# EAGLE design 42mm_Erweiterungsplatine (EAGLE 9.6.2)
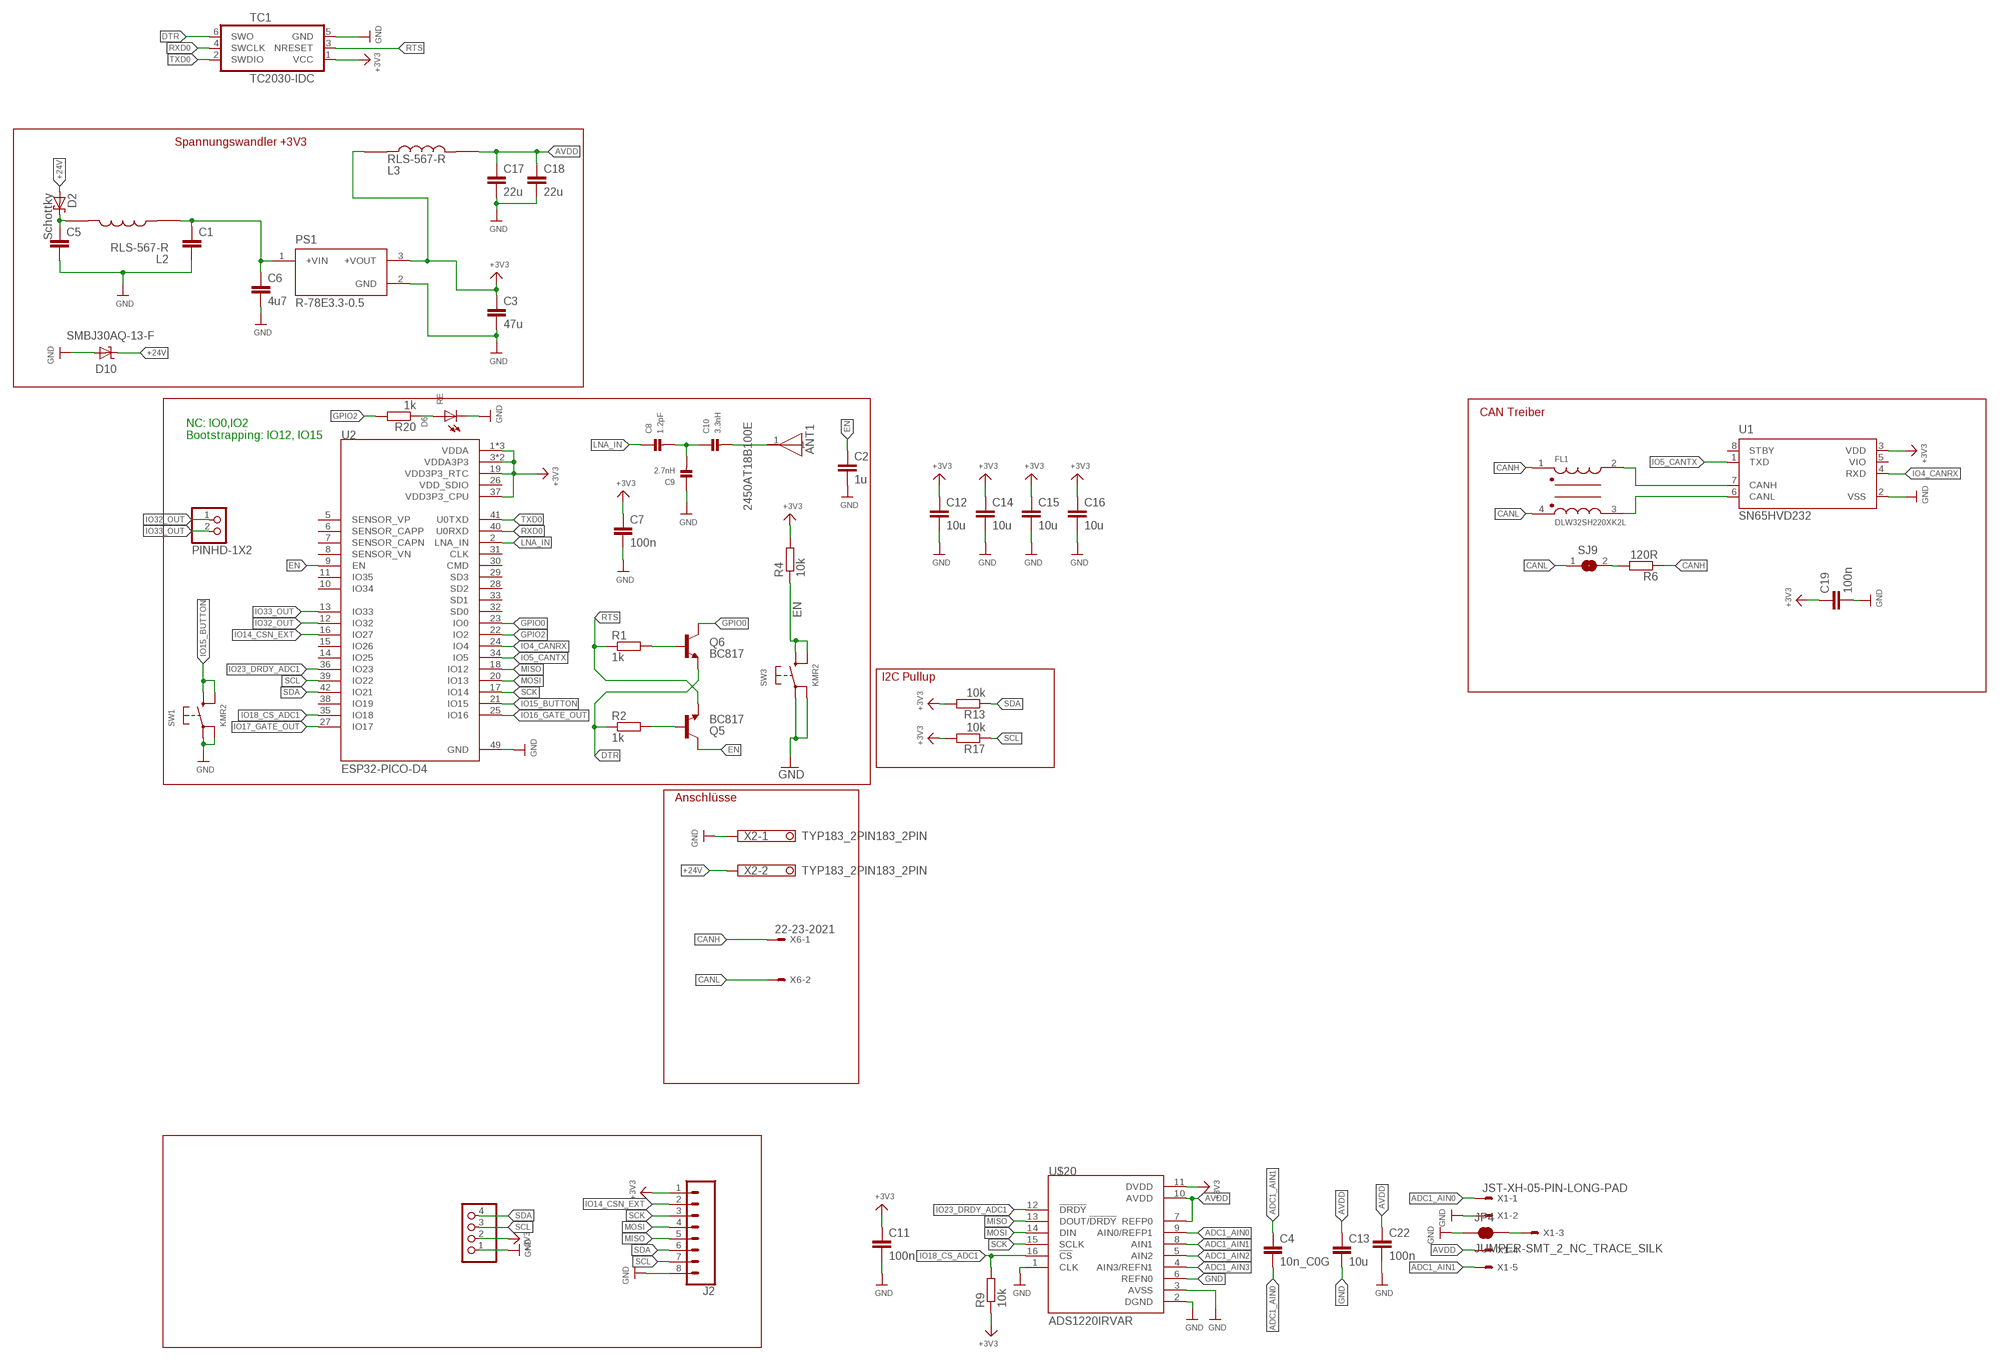
[diagram p0: schematic, sheet 1]

## Parts
ANT1  2450AT18B100E  [ANT_2450AT18B100E]
C1  C-EUC1206K  [C1206K]
C2  1u  C-EUC0805  [C0805]
C3  47u  C-EUC0805  [C0805]
C4  10n_C0G  C-EUC0805  [C0805]
C5  C-EUC1206K  [C1206K]
C6  4u7  C-EUC0805  [C0805]
C7  100n  C-EUC0805  [C0805]
C8  1.2pF  CAP_CERAMIC_0402MP  [_0402MP]
C9  2.7nH  CAP_CERAMIC_0402MP  [_0402MP]
C10  3.3nH  CAP_CERAMIC_0402MP  [_0402MP]
C11  100n  C-EUC0805  [C0805]
C12  10u  C-EUC0805  [C0805]
C13  10u  C-EUC0805  [C0805]
C14  10u  C-EUC0805  [C0805]
C15  10u  C-EUC0805  [C0805]
C16  10u  C-EUC0805  [C0805]
C17  22u  C-EUC0805  [C0805]
C18  22u  C-EUC0805  [C0805]
C19  100n  C-EUC0805  [C0805]
C22  100n  C-EUC0805  [C0805]
D2  Schottky  SCHOTTKY-DIODESMD  [SMB]
D6  RE  LEDCHIP-LED0805  [CHIP-LED0805]
D10  SMBJ30AQ-13-F  SUPPRESSOR-SMBJ  [SMBJ]
FL1  DLW32SH220XK2L  DLW32SH110XK2L  [FIL_DLW32SH110XK2L]
J2  CONN_08BM08B-SRSS-TB  [BM08B-SRSS-TB]
JP1  PINHD-1X4  [1X04]
JP4  JUMPER-SMT_2_NC_TRACE_SILK  [SMT-JUMPER_2_NC_TRACE_SILK]
JP5  PINHD-1X2  [1X02]
L2  RLS-567-R  [IND_RLS-567-R]
L3  RLS-567-R  [IND_RLS-567-R]
PS1  R-78E3.3-0.5  [CONV_R-78E3.3-0.5]
Q5  BC817  TRANSISTOR_NPNSOT23-3  [SOT23-3]
Q6  BC817  TRANSISTOR_NPNSOT23-3  [SOT23-3]
R1  1k  R-EU_R0805  [R0805]
R2  1k  R-EU_R0805  [R0805]
R4  10k  R-EU_R0805  [R0805]
R6  120R  R-EU_R0805  [R0805]
R9  10k  R-EU_R0805  [R0805]
R13  10k  R-EU_R0805  [R0805]
R17  10k  R-EU_R0805  [R0805]
R20  1k  R-EU_R0805  [R0805]
SJ9  SJ  [SJ]
SW1  KMR2  SWITCH_TACT_SMT4.6X2.8  [BTN_KMR2_4.6X2.8]
SW3  KMR2  SWITCH_TACT_SMT4.6X2.8  [BTN_KMR2_4.6X2.8]
TC1  TC2030-IDC  [TC2030-IDC]
U1  SN65HVD232  MCP2562-E/SN  [SOIC127P600X175-8N]
U2  ESP32-PICO-D4  [PQFN50P700X700X104-49N]
U$20  ADS1220IRVAR  [QFN50P350X350X100-17N214X214]
X1  JST-XH-05-PIN-LONG-PAD  [JST-XH-05-PACKAGE-LONG-PAD]
X2  TYP183_2PIN183_2PIN  [TYP183_FT_2PIN]
X6  22-23-2021  [22-23-2021]

## Nets
+3V3: C3.1 C7.1 C11.1 C12.1 C14.1 C15.1 C16.1 C19.1 J2.1 JP1.2 L3.1 PS1.3(+VOUT) R4.2 R9.1 R13.2 R17.2 TC1.1(VCC) U1.3(VDD) U2.1(VDDA) U2.3(VDDA3P3) U2.4(VDDA3P3) U2.19(VDD3P3_RTC) U2.37(VDD3P3_CPU) U2.43(VDDA) U2.46(VDDA) U$20.11(DVDD)
+24V: D2.A D10.C X2.2
ADC1_AIN0: C4.2 U$20.9(AIN0/REFP1) X1.1
ADC1_AIN1: C4.1 U$20.8(AIN1) X1.5
ADC1_AIN2: U$20.5(AIN2)
ADC1_AIN3: U$20.4(AIN3/REFN1)
AVDD [power]: C13.1 C17.1 C18.1 C22.1 L3.2 U$20.7(REFP0) U$20.10(AVDD) X1.4
CANH: FL1.1 R6.1 X6.1
CANL: FL1.4 SJ9.1 X6.2
DTR: Q6.2(E) R2.1 TC1.6(SWO)
EN: C2.1 Q5.3(C) R4.1 SW3.B'(S1) SW3.B(S) U2.9(EN)
GND: C1.2 C2.2 C3.2 C5.2 C6.2 C7.2 C9.1 C11.2 C12.2 C13.2 C14.2 C15.2 C16.2 C17.2 C18.2 C19.2 C22.2 D6.C D10.A J2.8 JP1.1 JP4.1 PS1.2(GND) SW1.A'(P1) SW1.A(P) SW3.A'(P1) SW3.A(P) TC1.5(GND) U1.2(VSS) U2.49(GND) U$20.1(CLK) U$20.2(DGND) U$20.3(AVSS) U$20.6(REFN0) X1.2 X2.1
GPIO0: Q6.3(C) U2.23(IO0)
GPIO2: R20.2 U2.22(IO2)
IO4_CANRX: U1.4(RXD) U2.24(IO4)
IO5_CANTX: U1.1(TXD) U2.34(IO5)
IO14_CSN_EXT: J2.2 U2.16(IO27)
IO15_BUTTON: SW1.B'(S1) SW1.B(S) U2.21(IO15)
IO16_GATE_OUT: U2.25(IO16)
IO17_GATE_OUT: U2.27(IO17)
IO18_CS_ADC1: R9.2 U2.35(IO18) U$20.16(!CS)
IO23_DRDY_ADC1: U2.36(IO23) U$20.12(!DRDY)
IO32_OUT: JP5.1 U2.12(IO32)
IO33_OUT: JP5.2 U2.13(IO33)
LNA_IN: C8.1 U2.2(LNA_IN)
MISO: J2.5 U2.18(IO12) U$20.13(DOUT/!DRDY)
MOSI: J2.4 U2.20(IO13) U$20.14(DIN)
N$2: C8.2 C9.2 C10.1
N$3: ANT1.1 C10.2
N$4: C5.1 D2.C L2.2
N$5: D6.A R20.1
N$6: C1.1 C6.1 L2.1 PS1.1(+VIN)
N$7: JP4.2 X1.3
N$8: FL1.2 U1.7(CANH)
N$11: FL1.3 U1.6(CANL)
N$12: Q5.1(B) R2.2
N$13: Q6.1(B) R1.2
N$16: R6.2 SJ9.2
RTS: Q5.2(E) R1.1 TC1.3(NRESET)
RXD0: TC1.4(SWCLK) U2.40(U0RXD)
SCK: J2.3 U2.17(IO14) U$20.15(SCLK)
SCL: J2.7 JP1.3 R17.1 U2.39(IO22)
SDA: J2.6 JP1.4 R13.1 U2.42(IO21)
TXD0: TC1.2(SWDIO) U2.41(U0TXD)
Unconnected: U1.8(STBY) U2.5(SENSOR_VP) U2.6(SENSOR_CAPP) U2.7(SENSOR_CAPN) U2.8(SENSOR_VN) U2.10(IO34) U2.11(IO35) U2.14(IO25) U2.15(IO26) U2.28(SD2) U2.29(SD3) U2.30(CMD) U2.31(CLK) U2.32(SD0) U2.33(SD1) U2.38(IO19)

## Notes on the sheet
- Spannungswandler +3V3
- CAN Treiber
- NC: IO0,IO2
  Bootstrapping: IO12, IO15
- I2C Pullup
- Anschlüsse

## Power pins joined to a net without a drawn wire
VDD_SDIO: U2.26(VDD_SDIO)
VIO: U1.5(VIO)

## Library data of the parts
ANT1 = 2450AT18B100E:2450AT18B100E: ANTENNA, CERAMIC, 2.45GHZ; Bandwidth: 100MHz; Frequency: 2.45GHz; Gain: -0.5dB; Impedance: 50ohm http://www.snapeda.com/parts/2450AT18B100E/Johanson/view-part/#; AVAILABILITY: Unavailable; DESCRIPTION: ANTENNA, CERAMIC, 2.45GHZ; Bandwidth: 100MHz; Frequency: 2.45GHz; Gain: -0.5dB; Impedance: 50ohm; MF: Johanson Technology; MP: 2450AT18B100E; PACKAGE: None; PRICE: None
C1-C7 C11-C19 C22 = rcl:C-EU: CAPACITOR, European symbol; SPICEPREFIX: C
C8-C10 = microbuilder:CAP_CERAMIC: Ceramic Capacitors 0402 - 0402 Surface Mount Capacitors 16pF 50V 5% [Digikey: 445-4899-2-ND] 18pF 50V 5% [Digikey: 490-1281-2-ND] 22pF 50V 5% [Digikey: 490-1283-2-ND] 68pF 50V 5% [Digikey: 490-1289-2-ND] 0.1uF 10V 10% [Digikey: 490-1318-2-ND] 1.0uF 6.3V 10% [Digikey: 490-1320-2-ND] 0603 - 0603 Surface Mount Capacitors 16 pF 50V 5% [Digikey: 445-5051-2-ND] 22 pF 50V [Digikey: PCC220ACVTR-ND] 33 pF 50V 5% [Digikey: 490-1415-1-ND] 56pF 50V 5% [Digikey: 490-1421-1-ND] 220pF 50V 5% [Digikey: 445-1285-1-ND] 680 pF 50V 2200 pF 50V 5% C0G [Digikey: 445-1297-1-ND] 5600 pF 100V 5% X7R [Digikey: 478-3711-1-ND] 0.1 µF 25V 10% [Digikey: PCC2277TR-ND] 0.22 µF 16V 10% X7R [Digikey: 445-1318-1-ND] 1.0 µF 25V 10% [Digikey: 445-5146-2-ND] 0603 - RF Specific 3pF 250V +/-0.1pF RF [Digikey: 712-1347-1-ND] 18 pF 250V 5% [Digikey: 478-3505-1-ND or 712-1322-1-ND] 56 pF 250V 5% C0G RF [Digikey: 490-4867-1-ND] 68 pF 250V RF [Digikey: 490-4868-1-ND] 0805 - 0805 Surface Mount Capacitors 220 pF 250V 2% RF Ceramic Capacitor [Digikey: 712-1398-1-ND] 1000 pF 50V 2% NP0 Ceramic Capacitor [Digikey: 478-3760-1-ND] 0.1 µF 25V 10% Ceramic Capacitor [Digikey: PCC1828TR-ND] 1.0 µF 16V 10% Ceramic Capacitor[Digikey: 490-1691-2-ND] 10.0 µF 10V 10% Ceramic Capacitor[Digikey: 709-1228-1-ND] 10.0 uF 16V 10% Ceramic Capacitor [Digikey: 478-5165-2-ND] 47 uF 6.3V 20% Ceramic Capacitor [Digikey: 587-1779-1-ND or 399-5506-1-ND] 1206 - 1206 Surface Mount Capacitors 47uF 10V 20% Ceramic Capacitor [Digikey: 490-5528-1-ND or 399-5508-1-ND or 445-6010-1-ND] 100uF 6.3V -20%, +80% Y5V Ceramic Capacitor (Digikey: 490-4512-1-ND, Mouser: 81-GRM31CF50J107ZE1L)
D2 = diode:SCHOTTKY-DIODE: Schottky Diode
D6 = led:LED: LED OSRAM: - CHIPLED LG R971, LG N971, LY N971, LG Q971, LY Q971, LO R971, LY R971 LH N974, LH R974 LS Q976, LO Q976, LY Q976 LO Q996 - Hyper CHIPLED LW Q18S LB Q993, LB Q99A, LB R99A - SideLED LS A670, LO A670, LY A670, LG A670, LP A670 LB A673, LV A673, LT A673, LW A673 LH A674 LY A675 LS A676, LA A676, LO A676, LY A676, LW A676 LS A679, LY A679, LG A679 - Hyper Micro SIDELED® LS Y876, LA Y876, LO Y876, LY Y876 LT Y87S - SmartLED LW L88C, LW L88S LB L89C, LB L89S, LG L890 LS L89K, LO L89K, LY L89K LS L896, LA L896, LO L896, LY L896 - TOPLED LS T670, LO T670, LY T670, LG T670, LP T670 LSG T670, LSP T670, LSY T670, LOP T670, LYG T670 LG T671, LOG T671, LSG T671 LB T673, LV T673, LT T673, LW T673 LH T674 LS T676, LA T676, LO T676, LY T676, LB T676, LH T676, LSB T676, LW T676 LB T67C, LV T67C, LT T67C, LS T67K, LO T67K, LY T67K, LW E67C LS E67B, LA E67B, LO E67B, LY E67B, LB E67C, LV E67C, LT E67C LW T67C LS T679, LY T679, LG T679 LS T770, LO T770, LY T770, LG T770, LP T770 LB T773, LV T773, LT T773, LW T773 LH T774 LS E675, LA E675, LY E675, LS T675 LS T776, LA T776, LO T776, LY T776, LB T776 LHGB T686 LT T68C, LB T68C - Hyper Mini TOPLED® LB M676 - Mini TOPLED Santana® LG M470 LS M47K, LO M47K, LY M47K Source: http://www.osram.convergy.de LUXEON: - LUMILED® LXK2-PW12-R00, LXK2-PW12-S00, LXK2-PW14-U00, LXK2-PW14-V00 LXK2-PM12-R00, LXK2-PM12-S00, LXK2-PM14-U00 LXK2-PE12-Q00, LXK2-PE12-R00, LXK2-PE12-S00, LXK2-PE14-T00, LXK2-PE14-U00 LXK2-PB12-K00, LXK2-PB12-L00, LXK2-PB12-M00, LXK2-PB14-N00, LXK2-PB14-P00, LXK2-PB14-Q00 LXK2-PR12-L00, LXK2-PR12-M00, LXK2-PR14-Q00, LXK2-PR14-R00 LXK2-PD12-Q00, LXK2-PD12-R00, LXK2-PD12-S00 LXK2-PH12-R00, LXK2-PH12-S00 LXK2-PL12-P00, LXK2-PL12-Q00, LXK2-PL12-R00 Source: www.luxeon.com KINGBRIGHT: KA-3528ASYC Source: www.kingbright.com
D10 = diode:SUPPRESSOR-: Suppressor diode
FL1 = DLW32SH110XK2L:DLW32SH110XK2L: 100UH-30%/+50% (AT 0.1MHZ) 150MA; AVAILABILITY: Unavailable; DESCRIPTION: 11µH @ 100kHz 2 Line Common Mode Choke Surface Mount 300mA DCR 400mOhm; MF: Murata; MP: DLW32SH110XK2L; PACKAGE: Horizontal-4 Murata; PRICE: None
J2 = SparkFun-Connectors:CONN_08: Multi connection point. Often used as Generic Header-pin footprint for 0.1 inch spaced/style header connections On any of the 0.1 inch spaced packages, you can populate with these: Break Away Headers - Straight <https://www.sparkfun.com/products/116> (PRT-00116) Break Away Male Headers - Right Angle <https://www.sparkfun.com/products/553> (PRT-00553) Female Headers <https://www.sparkfun.com/products/115> (PRT-00115) Break Away Headers - Machine Pin <https://www.sparkfun.com/products/117> (PRT-00117) Break Away Female Headers - Swiss Machine Pin <https://www.sparkfun.com/products/743> (PRT-00743) Arduino Stackable Header - 8 Pin <https://www.sparkfun.com/products/9279> (PRT-09279) For SCREWTERMINALS and SPRING TERMINALS visit here: Screw Terimnals on SparkFun.com <https://www.sparkfun.com/search/results?term=Screw+Terminals> (5mm/3.5mm/2.54mm spacing) This device is also useful as a general connection point to wire up your design to another part of your project. Our various solder wires solder well into these plated through hole pads. Hook-Up Wire - Assortment (Stranded, 22 AWG) <https://www.sparkfun.com/products/11375> (PRT-11375) Hook-Up Wire - Assortment (Solid Core, 22 AWG) <https://www.sparkfun.com/products/11367> (PRT-11367) View the entire wire category on our website here <https://www.sparkfun.com/categories/141> Special notes: Molex polarized connector foot print use with SKU : PRT-08231 with associated crimp pins and housings. 1MM SMD Version SKU: PRT-10208 NOTES ON THE VARIANTS LOCK and LOCK_LONGPADS... This footprint was designed to help hold the alignment of a through-hole component (i.e. 6-pin header) while soldering it into place. You may notice that each hole has been shifted either up or down by 0.005 of an inch from it's more standard position (which is a perfectly straight line). This slight alteration caused the pins (the squares in the middle) to touch the edges of the holes. Because they are alternating, it causes a "brace" to hold the component in place. 0.005 has proven to be the perfect amount of "off-center" position when using our standard breakaway headers. Although looks a little odd when you look at the bare footprint, once you have a header in there, the alteration is very hard to notice. Also,if you push a header all the way into place, it is covered up entirely on the bottom side.; PROD_ID: CONN-10556
JP1 = pinhead:PINHD-1X4: PIN HEADER
JP4 = SparkFun-Jumpers:JUMPER-SMT_2_NC_TRACE: Normally closed trace jumper This jumper has a trace between two pads so it's normally closed (NC). Use a razor knife to open the connection. For best results follow the IPC guidelines for cutting traces: Cutout at least 0.063 mm (0.005 in). Remove all loose material to clean up the cut area. Seal the cut with an approved epoxy. Reapply solder to reclose the connection.
JP5 = Connector:PINHD-1X2: PIN HEADER; CATEGORY: CONNECTOR; SUB-CATEGORY: PIN-HEADER
L2 L3 = RLS-567-R:RLS-567-R: Line Inductors for RECOM Power Supply Check prices <https://pricing.snapeda.com/parts/RLS-567-R/Recom%20Power/view-part?ref=eda>; AVAILABILITY: In Stock; DESCRIPTION: Line Inductors for RECOM Power Supply; MF: Recom Power; MP: RLS-567-R; PACKAGE: 1812 Recom Power; PRICE: None; PURCHASE-URL: https://pricing.snapeda.com/search/part/RLS-567-R/?ref=eda
PS1 = R-78E3.3-0.5:R-78E3.3-0.5: 0.5 Amp SIP3 Single Output Check prices <https://pricing.snapeda.com/parts/R-78E3.3-0.5/Recom%20Power/view-part?ref=eda>; AVAILABILITY: In Stock; DESCRIPTION: 0.5A DC/DC-Converter 'INNOLINE' SIP3 reg; MF: Recom Power; MP: R-78E3.3-0.5; PACKAGE: SIP-3 Recom Power; PRICE: None; PURCHASE-URL: https://pricing.snapeda.com/search/part/R-78E3.3-0.5/?ref=eda
Q5 Q6 = SparkFun:TRANSISTOR_NPN: Transistor NPN BJT configuration in SOT23 package. MMBT2222 is the common NPN we use. Double check BCE configuration again layout.
R1 R2 R4 R6 R9 R13 R17 R20 = rcl:R-EU_: RESISTOR, European symbol; SPICEPREFIX: R
SJ9 = jumper:SJ: SMD solder JUMPER
SW1 SW3 = microbuilder:SWITCH_TACT_SMT: SMT Tact Switches 6x6mm - Digikey: P12940SCT-ND KMR2 (4.6x2.8mm) - Digikey: 401-1426-1-ND EVQ-PQHB55 - Light Touch, 160GF (4.5x4.5mm) - Digikey: P8090SCT-ND KMT0 - KMT021 NGJ LHS (etc.) IP68/Waterproof - Digikey: CKN10289CT-ND
TC1 = TC2030-IDC:TC2030-IDC: Tag-Connect In Circuit Programming & Debug Cable 6 Pin http://www.tag-connect.com; AVAILABILITY: Unavailable; DESCRIPTION: Cable Adapter 6 Pos; MF: Tag-Connect LLC; MP: TC2030-IDC; PACKAGE: None; PRICE: None
U1 = MCP2562-E_SN:MCP2562-E/SN: MCP2562 Series 5 V Surface Mount High-Speed CAN Transceiver - SOIC-8; AVAILABILITY: Unavailable; DESCRIPTION: Microchip MCP2562-E/SN, CAN Transceiver 1MBps 1-channel IEC 61000-4-2, 8-Pin SOIC; MF: Microchip; MP: MCP2562-E/SN; PACKAGE: SO-8 Microchip; PRICE: None
U2 = ESP32-PICO-D4:ESP32-PICO-D4: The ESP32-PICO-D4 is a System-in-Package (SIP) module that is based on ESP32, providing complete Wi-Fi and Bluetooth functionalities. The module has a size as small as 7.0±0.1 mm×7.0±0.1 mm×0.94±0.1 mm, thus requiring minimal PCB area. The module integrates a 4-MB SPI flash; AVAILABILITY: Unavailable; DESCRIPTION: Bluetooth, WiFi 802.11b/g/n, Bluetooth v4.2 + EDR, Class 1, 2 and 3 Transceiver Module 2.4GHz ~ 2.5GHz Surface Mount; MF: Espressif Systems; MP: ESP32-PICO-D4; PACKAGE: SMD-48 Espressif Systems; PRICE: None
U$20 = ADS1220IRVAR:ADS1220IRVAR
X1 = Rembrandt Electronics - JST XH Connectors v1-0:JST-XH-05-PIN: JST XH Connector 2 Pin Wire to board connector. Pitch: 2,54 mm, (0.100") Number of pins: 5 Created by Rembrandt Electronics www.rembrandtelectronics.com
X2 = MetzConnect182_183:TYP183_2PIN: PT11303VBBN (Typ 183)
X6 = con-molex:22-23-2021: .100" (2.54mm) Center Header - 2 Pin; MF: MOLEX; MPN: 22-23-2021; OC_FARNELL: 1462926; OC_NEWARK: 25C3832

## Net classes
1 power: width 0.254 mm

## Board
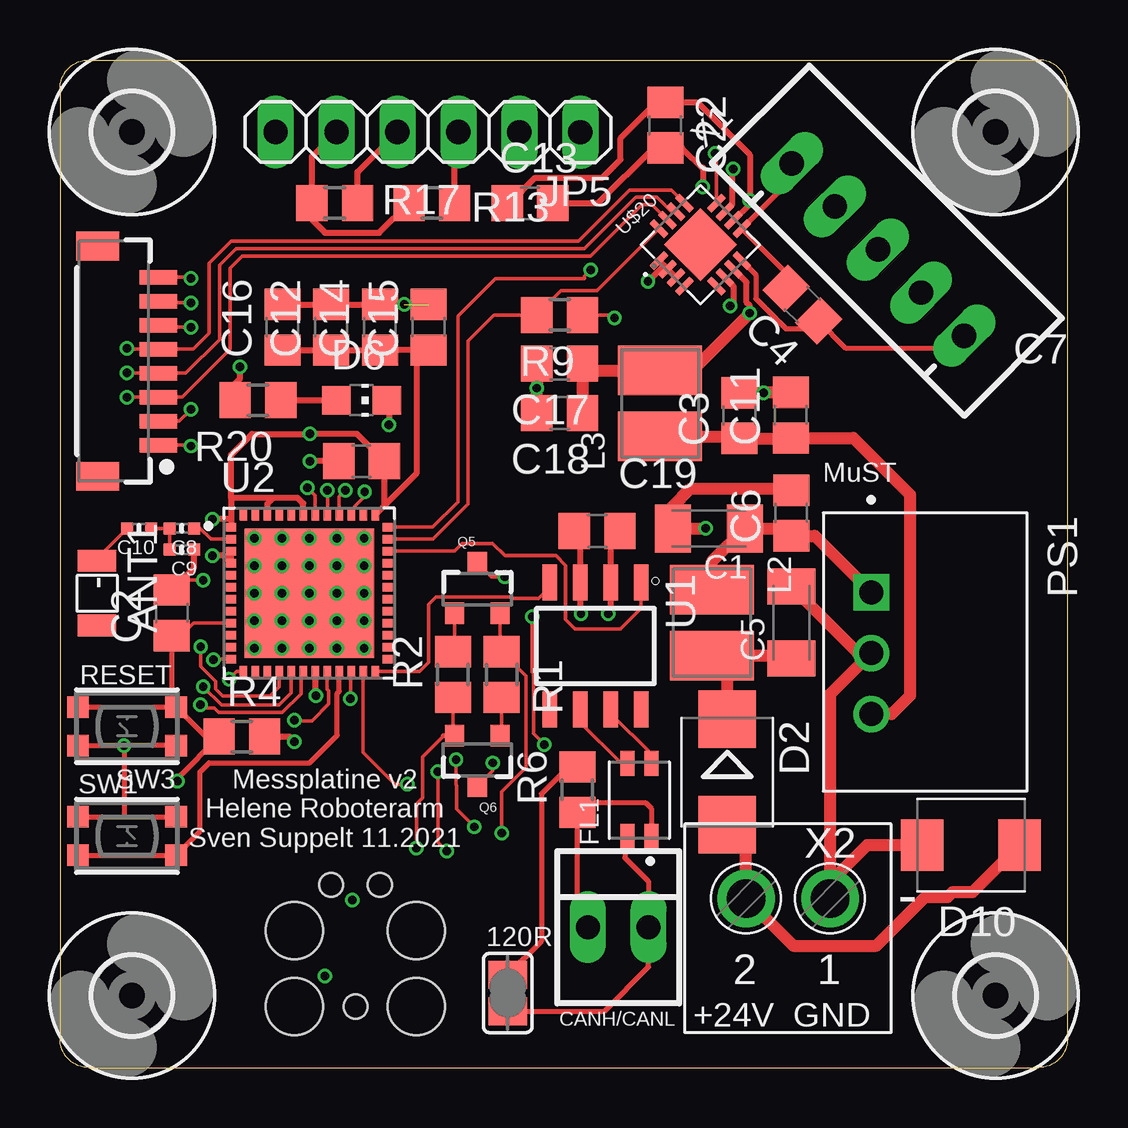
[diagram p1: board, top side]
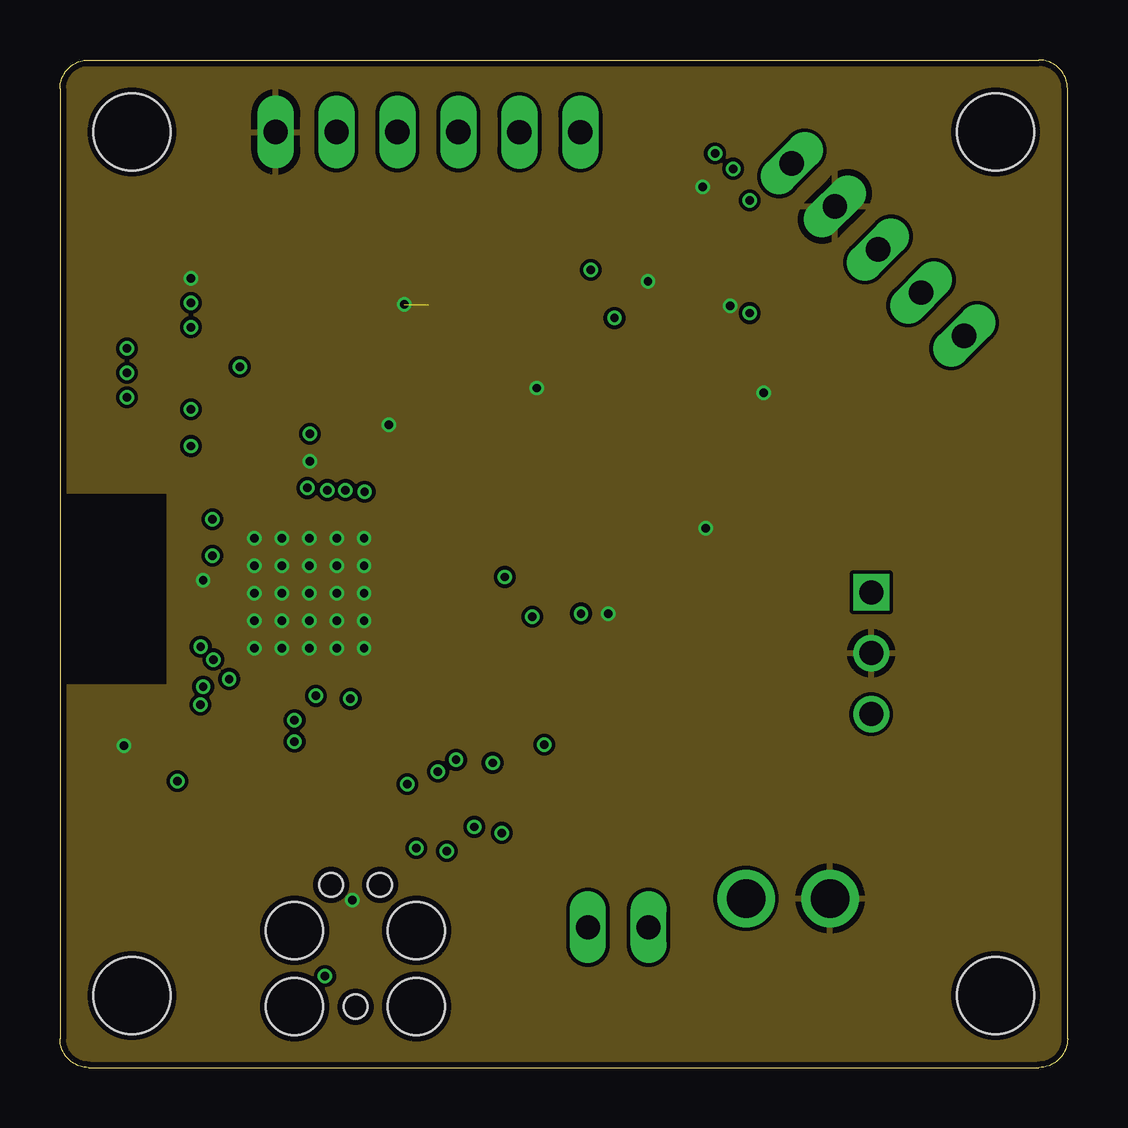
[diagram p2: board, inner layer Route2]
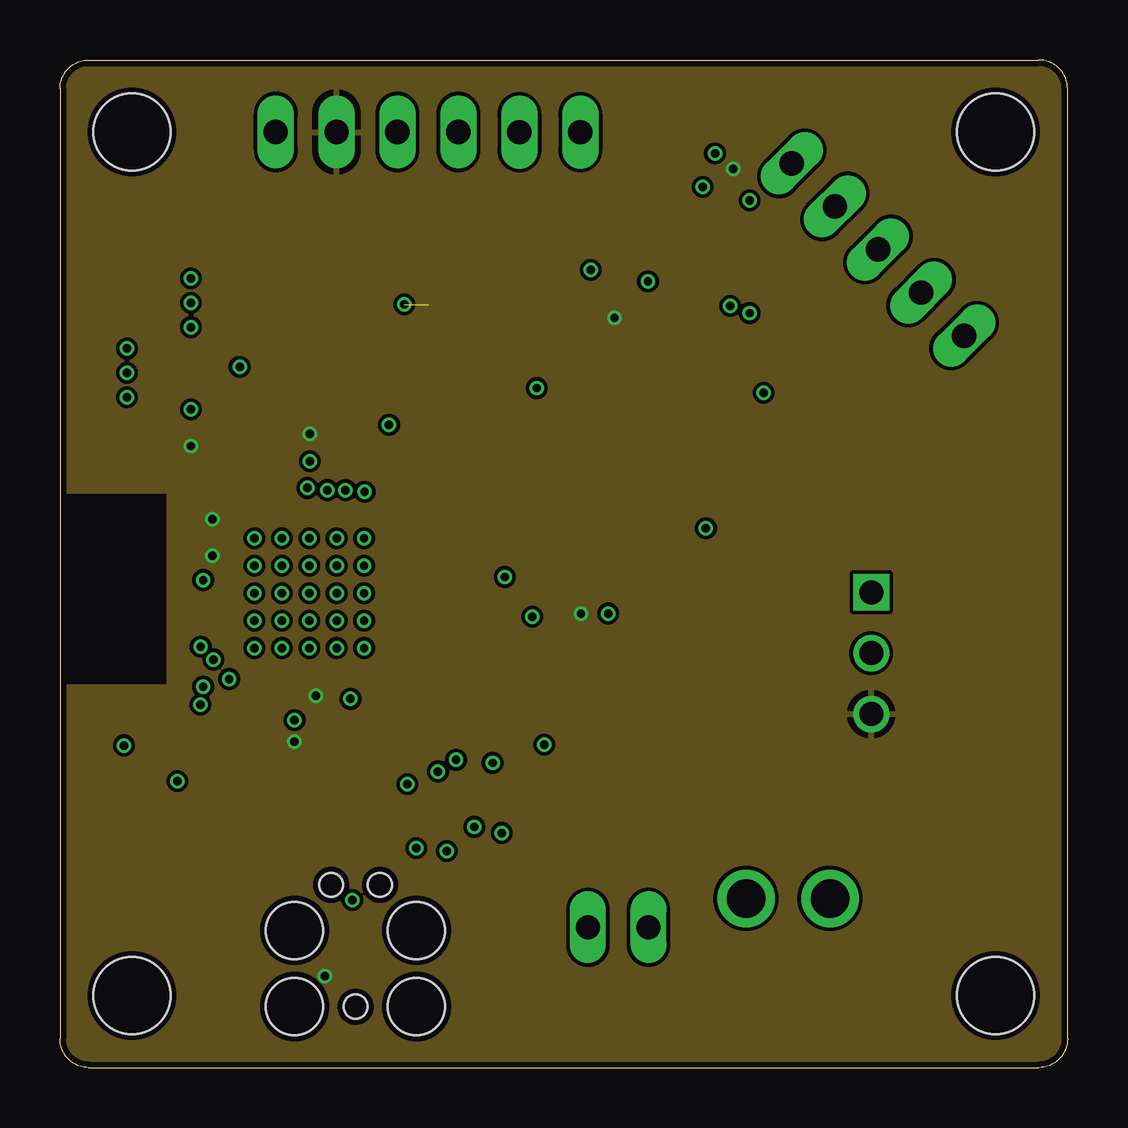
[diagram p3: board, inner layer Route15]
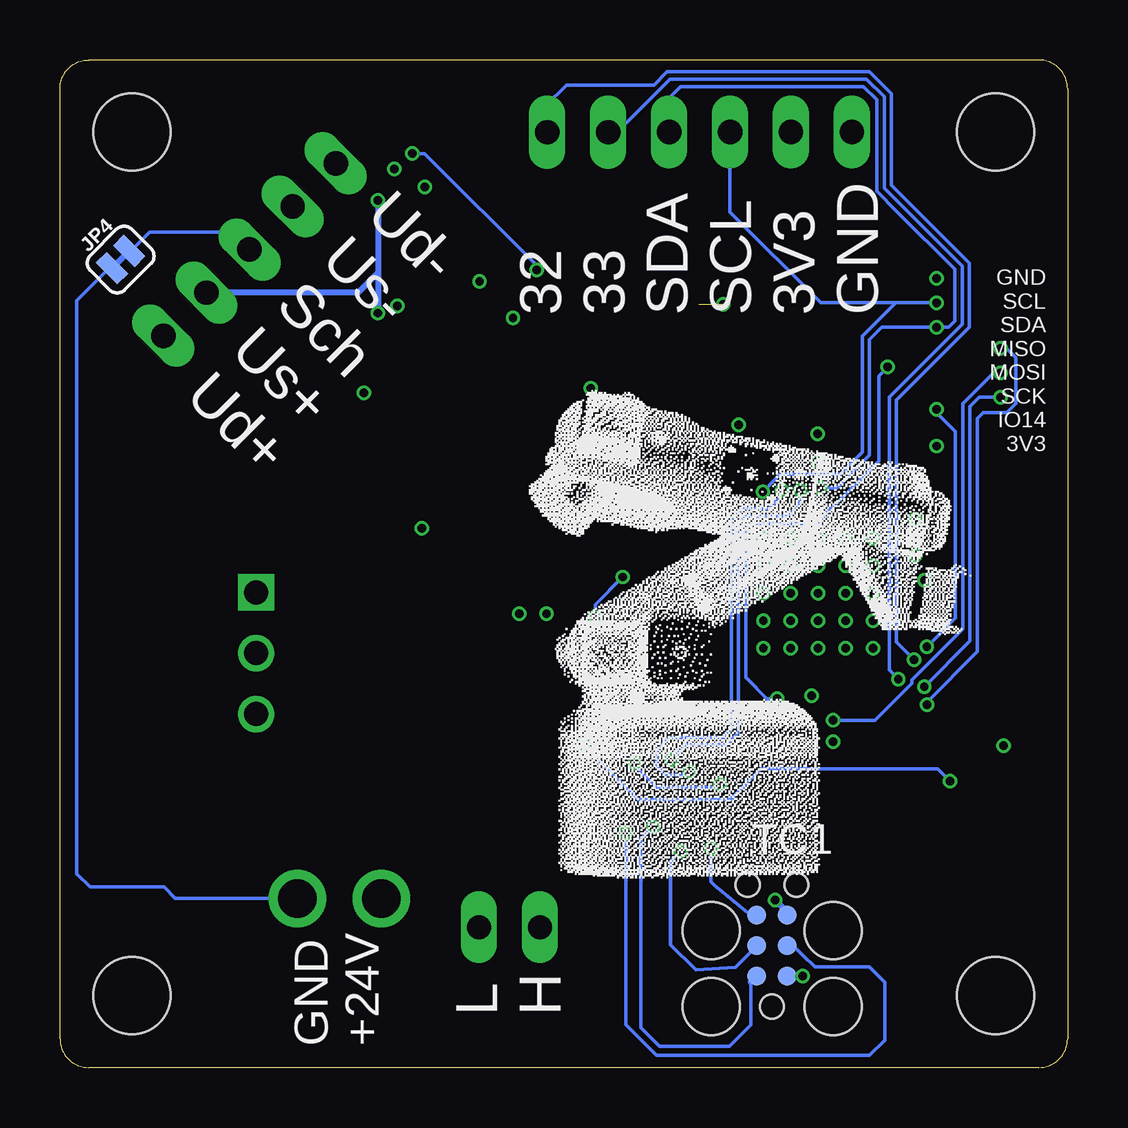
[diagram p4: board, bottom side, seen from below]

Size 42 x 42 mm. Coordinates in mm from the lower left corner, seen from the top.
Outline: 1.2,0 40.8,0 arc90 42,1.2 42,40.8 arc90 40.8,42 1.2,42 arc90 0,40.8 0,1.2 arc90 1.2,0
Copper layers (1+2*15+16): Top 0.035mm / dielectric 0.2mm / Route2 0.0175mm / dielectric 1.065mm / Route15 0.0175mm / dielectric 0.2mm / Bottom 0.035mm
Design rules "DesignRule4Layer": minimum track width 6mil, minimum drill 0.2mm, track to track 6mil, track to pad 6mil, pad to pad 6mil, via to via 6mil, smd to smd 6mil, copper to edge 10mil, drill to drill 6mil, minimum pad ring 10mil, minimum via ring 0.125mm, stop-mask expansion 4mil, vias tented up to drill 0.4mm, thermal gap 10mil

### Footprints (pad centres in the part's own frame; a part is rotated, then mirrored left to right if it is on the bottom)
ANT_2450AT18B100E = smd 0.9 x 1.6: 1 -1.35,0; 2 1.35,0
C1206K = smd 1.5 x 2: 1 -1.5,0; 2 1.5,0
C0805 = smd 1.3 x 1.5: 1 -0.95,0; 2 0.95,0
_0402MP = smd 0.5 x 0.5: 1 -0.508,0; 2 0.508,0
SMB = smd 2.4 x 2.4: A 2.2,0; C -2.2,0
CHIP-LED0805 = smd 1.2 x 1.2: A 0,-1.05; C 0,1.05
SMBJ = smd 1.78 x 2.16: A 2.04,0; C -2.03,0
FIL_DLW32SH110XK2L = smd 1.05 x 0.6: 1 -1.525,-0.5; 2 1.525,-0.5; 3 1.525,0.5; 4 -1.525,0.5
BM08B-SRSS-TB = smd 0.6 x 1.55: 1 -3.5,0; 2 -2.5,0; 3 -1.5,0; 4 -0.5,0; 5 0.5,0; 6 1.5,0; 7 2.5,0; 8 3.5,0 | smd 1.2 x 1.8: P$9 4.8,2.525; P$10 -4.8,2.525
1X04 = drill 1.016 long: 1 -3.81,0; 2 -1.27,0; 3 1.27,0; 4 3.81,0
SMT-JUMPER_2_NC_TRACE_SILK = smd 0.635 x 1.27: 1 -0.508,0; 2 0.508,0
1X02 = drill 1.016 long: 1 -1.27,0; 2 1.27,0
IND_RLS-567-R = smd 2.05 x 3.5: 1 -1.375,0; 2 1.375,0
CONV_R-78E3.3-0.5 = drill 1 square: 1 -2.54,-2.25 | drill 1: 2 0,-2.25; 3 2.54,-2.25
SOT23-3 = smd 0.8 x 0.9: 1 -0.95,-1; 2 0.95,-1; 3 0,1.1
R0805 = smd 1.3 x 1.5: 1 -0.95,0; 2 0.95,0
SJ = smd 1.168 x 1.6: 1 -0.762,0; 2 0.762,0
BTN_KMR2_4.6X2.8 = smd 0.9 x 0.9: A 2.05,0.8; A' -2.05,0.8; B 2.05,-0.8; B' -2.05,-0.8
TC2030-IDC = smd 0.787 x 0.787: 1 -1.27,-0.635; 2 -1.27,0.635; 3 0,-0.635; 4 0,0.635; 5 1.27,-0.635; 6 1.27,0.635 | hole 0.991: -2.54,0; 2.54,1.016; 2.54,-1.016 | hole 2.375: -2.54,2.54; -2.54,-2.54; 0.635,2.54; 0.635,-2.54
SOIC127P600X175-8N = smd 1.5 x 0.6: 1 -2.65,1.905; 2 -2.65,0.635; 3 -2.65,-0.635; 4 -2.65,-1.905; 5 2.65,-1.905; 6 2.65,-0.635; 7 2.65,0.635; 8 2.65,1.905
PQFN50P700X700X104-49N = smd 0.45 x 0.35: 1 -3.265,2.75; 2 -3.265,2.25; 3 -3.265,1.75; 4 -3.265,1.25; 5 -3.265,0.75; 6 -3.265,0.25; 7 -3.265,-0.25; 8 -3.265,-0.75; 9 -3.265,-1.25; 10 -3.265,-1.75; 11 -3.265,-2.25; 12 -3.265,-2.75; 25 3.265,-2.75; 26 3.265,-2.25; 27 3.265,-1.75; 28 3.265,-1.25; 29 3.265,-0.75; 30 3.265,-0.25; 31 3.265,0.25; 32 3.265,0.75; 33 3.265,1.25; 34 3.265,1.75; 35 3.265,2.25; 36 3.265,2.75 | smd 0.35 x 0.45: 13 -2.75,-3.265; 14 -2.25,-3.265; 15 -1.75,-3.265; 16 -1.25,-3.265; 17 -0.75,-3.265; 18 -0.25,-3.265; 19 0.25,-3.265; 20 0.75,-3.265; 21 1.25,-3.265; 22 1.75,-3.265; 23 2.25,-3.265; 24 2.75,-3.265; 37 2.75,3.265; 38 2.25,3.265; 39 1.75,3.265; 40 1.25,3.265; 41 0.75,3.265; 42 0.25,3.265; 43 -0.25,3.265; 44 -0.75,3.265; 45 -1.25,3.265; 46 -1.75,3.265; 47 -2.25,3.265; 48 -2.75,3.265 | smd 5.4 x 5.4: 49 0,0
3,2 = hole 3.2: 0,0
QFN50P350X350X100-17N214X214 = smd 0.84 x 0.26: 1 -1.69,0.75; 2 -1.69,0.25; 3 -1.69,-0.25; 4 -1.69,-0.75; 9 1.69,-0.75; 10 1.69,-0.25; 11 1.69,0.25; 12 1.69,0.75 | smd 0.26 x 0.84: 5 -0.75,-1.69; 6 -0.25,-1.69; 7 0.25,-1.69; 8 0.75,-1.69; 13 0.75,1.69; 14 0.25,1.69; 15 -0.25,1.69; 16 -0.75,1.69 | smd 2.14 x 2.14: 17 0,0
JST-XH-05-PACKAGE-LONG-PAD = drill 1.016 long: 1 -5.08,0; 2 -2.54,0; 3 0,0; 4 2.54,0; 5 5.08,0
TYP183_FT_2PIN = drill 1.6 pad 2.2: 1 -1.75,-0.1; 2 1.75,-0.1
22-23-2021 = drill 1 long: 1 -1.27,0; 2 1.27,0

### Placement (x,y rotation side)
ANT1  1.54,19.78 270 top
C1  27.05,22.48 180 top
C2  4.66,18.95 90 top
C3  28.32,27.18 90 top
C4  30.95,31.8 135 top
C5  30.48,18.54 90 top
C6  30.48,23.11 90 top
C7  12.57,25.27 180 top
C8  5.08,22.48 180 top
C9  5.08,21.59 180 top
C10  3.3,22.48 180 top
C11  30.46,27.2 90 top
C12  11.3,30.86 90 top
C13  19.59,36.02 0 top
C14  13.34,30.86 90 top
C15  15.37,30.86 90 top
C16  9.27,30.86 90 top
C17  20.83,29.34 180 top
C18  20.83,27.28 180 top
C19  22.39,22.36 0 top
C22  25.23,39.28 270 top
D2  27.81,12.32 270 top
D6  12.57,27.81 270 top
D10  37.97,9.27 180 top
FL1  24.16,11.15 90 top
J2  4.1,29.44 90 top
JP1  12.8,39 0 top
JP4  39.47,33.68 45 bottom
JP5  20.42,38.99 180 top
L2  27.18,18.54 270 top
L3  25.02,27.69 90 top
PS1  36.07,17.27 270 top
Q5  17.4,19.94 0 top
Q6  17.4,12.83 180 top
R1  18.41,16.38 270 top
R2  16.38,16.38 90 top
R4  7.59,13.79 0 top
R6  21.57,11.58 90 top
R9  20.83,31.37 180 top
R13  15.5,36.04 180 top
R17  11.45,36.04 180 top
R20  8.26,27.81 180 top
SJ9  18.67,3.11 90 top
SW1  2.79,9.65 0 top
SW3  2.79,14.22 180 top
TC1  12.32,5.08 90 bottom
U1  22.32,17.57 270 top
U2  10.39,19.77 0 top
U$1  [3,2]  3,39 0 top
U$2  [3,2]  39,39 0 top
U$3  [3,2]  3,3 0 top
U$4  [3,2]  39,3 0 top
U$20  26.7,34.3 45 top
X1  34.1,34.1 315 top
X2  30.35,6.95 180 top
X6  23.27,5.85 0 top

### Tracks (layer width: path | path; a pad name or v marks a point on that pad's centre or on a via)
+3V3  (via drill 0.35)
  Top 0.152: J2.1 5.42,25.94 v5.46,25.91 | R9.1 22.99,31.37 v23.11,31.24
  Top 0.254: C19.1 21.68,22.12 U1.3 21.68,18.95 v21.72,18.92 | R4.2 9.57,13.79 v9.78,13.59 | 7.13,23.75 7.13,22.86 | 7.13,22.86 U2.1 | U2.3 U2.4 6.81,21.34 v6.35,21.34 | 7.13,22.86 v6.35,22.86 | JP1.2 10.5,37.97 R17.2 10.5,35.35 11.05,34.8 13.31,34.8 R13.2 | U$20.11 28.03,35.98 28.03,37.43 v28.07,37.47 | U2.43 10.14,23.51 9.91,23.75 8.89,23.75 | 8.89,23.75 8.64,23.5 U2.46 | 8.89,23.75 7.13,23.75 | U2.19 10.64,15.52 v10.67,15.49 | 7.13,23.75 7.13,25.54 8,26.42 v10.41,26.42 12.38,26.42 C7.1 13.52,23.42 U2.37 14.86,24.76 14.86,29.4 C15.1 C14.1 C12.1 C16.1
  Top 0.508: PS1.3 34.67,14.73 35.43,15.49 35.43,23.88 33.06,26.25 C11.1 30.45,26.23 C3.1 28.24,26.31 L3.1
  Bottom 0.254: TC1.1 v11.05,3.81
  pour Route15: 0.1,41.9 0.01,24 4.5,24 4.5,15.9 0.1,15.9 0.1,0.1 10.19,0.1 10.19,0.13 17.91,0.13 17.91,0 41.9,0.1 41.9,41.9 25,41.9 25,41.87 7,41.87 7,41.9
+24V
  Top 0.508: D2.A 28.6,9.33 X2.2 30.57,5.08 34.04,5.08 36.07,7.11 37.01,7.11 37.21,7.32 38.05,7.32 D10.C
ADC1_AIN0
  Top 0.203: X1.1 30.51,37.05 U$20.9 30.28,33.11 C4.2
ADC1_AIN1
  Top 0.203: U$20.8 29,33.06 29,32.05 30.25,30.8 31.29,30.8 C4.1 32.75,30 37.18,30 X1.5
AVDD  (via drill 0.35)
  Top 0.254: U$20.10 28.75,36 v28.75,36.15 28.75,38.05 26.57,40.23 C22.1 24.86,40.23 23.37,38.73 23.37,37.85 22.61,37.08 19.81,37.08 18.75,36.02 C13.1 | v28.75,31.45 28.75,31.76 28.62,31.89 28.62,32.73 U$20.7
  Top 0.508: C18.1 C17.1 22.05,29.06 L3.2 26.36,29.06 v28.75,31.45
  Bottom 0.254: v28.75,36.15 28.75,33.13 | 28.75,33.13 v28.75,31.45 | 28.75,33.13 29.58,32.3 X1.4
CANH
  Top 0.203: X6.1 21.57,6.28 R6.1 21.99,11.05 24.4,11.05 24.66,10.79 FL1.1
CANL
  Top 0.203: FL1.4 23.55,9.52 23.55,8.74 24.54,7.75 X6.2 24.54,4.19 22.7,2.35 SJ9.1
DTR  (via drill 0.35)
  Top 0.152: R2.1 16.38,13.89 Q6.2 | v14.86,9.14 14.86,10.99 15.11,11.25 15.11,12.95 15.99,13.83
  Top 0.2: Q6.2 15.99,13.83
  Bottom 0.152: v14.86,9.14 14.86,7.75 14.73,7.62 13.21,6.35
  Bottom 0.254: TC1.6 13.21,6.35
EN  (via drill 0.35)
  Top 0.152: 4.9,17.85 4.9,18.24 C2.1 | U2.9 5.57,18.52 4.9,17.85 | 4.9,17.85 4.77,17.73 | Q5.3 17.99,20.45 v18.54,20.45 | v19.68,18.8 19.68,16.49 19.74,16.44 19.74,13.92 v20.19,13.46
  Top 0.203: C2.1 4.66,15.21 4.79,15.08 | 4.79,15.08 SW3.B' 6.08,13.79 R4.1 4.9,12.06 v4.9,11.94 | SW3.B 4.74,15.02 4.79,15.08
  Bottom 0.152: v18.54,20.45 19.68,19.3 v19.68,18.8 | v20.19,13.46 17.91,11.18 14.04,11.18 12.77,12.45 5.41,12.45 v4.9,11.94
GND  (via drill 0.35)  (1 unrouted)
  Top 0.152: J2.8 5.41,32.94 v5.46,32.89 | C2.2 5.08,20.32 v5.97,20.32
  Top 0.203: SW3.A v2.67,13.42 | SW3.A' v2.67,13.42 | SW1.A' 2.67,10.45 | 2.67,10.45 SW1.A | v2.67,13.42 2.67,10.45
  Top 0.254: C19.2 22.95,21.98 U1.2 22.95,19.02 v22.86,18.92 | C6.2 30.83,23.71 | C2.2 5.59,20.83 C9.1 | C7.2 v10.41,25.27 | U$20.6 28.07,32.58 28.07,31.88 v27.94,31.75 | 26.8,37.51 26.8,37.47 | 26.8,37.47 v26.8,36.7 | U$20.1 25.18,33.43 | 25.18,33.43 U$20.2 U$20.3 | 25.18,33.43 v24.51,32.77 | v24.51,32.77 | D6.C 13.72,27.72 v13.72,26.8 | 26.8,37.47 25.93,38.33 C22.2 24.74,38.33 22.44,36.02 C13.2 | 15.62,31.81 C15.2 C14.2 C12.2 C16.2
  Top 0.508: D10.A 33.66,9.27 32.1,7.72 X2.1 32.1,15.55 PS1.2 33.25,17.27 C5.2 | C6.2 30.41,24.13 26.29,24.13 25.55,23.39 C1.2 v26.92,22.48 | C3.2 v29.34,28.13 30.45,28.13 C11.2 | C18.2 v19.88,28.32 C17.2
  Bottom 0.152: X2.1 37.2,7.05 37.67,7.52 40.74,7.52 41.3,8.08 41.3,31.98 39.96,33.32 JP4.1
  Bottom 0.254: v12.19,6.99 11.68,6.48 TC1.5
  other vias: 10.39,19.77 11.53,19.77 12.68,19.77 11.53,20.92 12.68,20.92 10.39,20.92 11.53,22.06 12.68,22.06 10.39,22.06 9.25,22.06 8.11,22.06 9.25,20.92 8.11,20.92 9.25,19.77 8.11,19.77 10.39,18.63 11.53,18.63 12.68,18.63 9.25,18.63 8.11,18.63 10.39,17.49 11.53,17.49 12.68,17.49 8.11,17.49 9.25,17.49 14.35,31.81
  pour Route2: 0.1,41.9 0.01,24 4.5,24 4.5,15.9 0.1,15.9 0.1,0.1 41.9,0.1 41.9,41.9
GPIO0  (via drill 0.35)
  Top 0.152: U2.23 12.64,13.14 13.97,11.81 v14.48,11.81 | Q6.3 18.03,12.36 v18.03,12.7
  Bottom 0.152: v18.03,12.7 18.03,12.57 17.14,11.68 14.61,11.68 v14.48,11.81
GPIO2  (via drill 0.35)
  Top 0.152: v12.11,15.37 12.11,16.48 U2.22
  Top 0.254: R20.2 7.3,28.51 7.49,28.7 v7.49,29.21
  Bottom 0.152: v7.49,29.21 7.87,28.83 7.87,25.27 10.46,22.68 13.21,22.68 13.41,22.48 13.41,16.26 12.52,15.37 v12.11,15.37
IO4_CANRX
  Top 0.152: U2.24 14.98,16.51 15.37,16.89 15.37,19.3 15.68,19.62 18.84,19.62 18.9,19.56 19.94,19.56 20.41,20.03 U1.4
IO5_CANTX
  Top 0.152: U1.1 24.23,19.14 23.37,18.29 21.46,18.29 21.08,18.67 21.08,20.93 20.67,21.34 18.54,21.34 18.03,21.84 16.76,21.84 16.44,21.52 U2.34
IO14_CSN_EXT  (via drill 0.35)
  Top 0.152: U2.16 9.14,15.87 8.76,15.49 6.78,15.49 6.5,15.78 6.5,16.09 5.87,16.73 v5.87,17.54 | v5.46,27.43 4.97,26.94 J2.2
  Bottom 0.152: v5.87,17.54 4.67,18.73 4.67,26.52 5.46,27.3 v5.46,27.43
IO15_BUTTON
  Top 0.203: SW1.B' SW1.B 5.84,9.85 5.84,12.32 6.22,12.7 10.41,12.7 11.56,13.84 11.56,15.6 11.64,15.68 U2.21
IO18_CS_ADC1
  Top 0.152: U$20.16 22.39,32.38 20.89,32.38 R9.2 18.1,31.37 17.02,30.29 17.02,23.48 15.56,22.02 U2.35
IO23_DRDY_ADC1  (via drill 0.35)
  Top 0.152: U2.36 15.54,22.52 16.59,23.57 16.59,31.32 18.16,32.89 21.87,32.89 21.87,32.99 v22.12,33.25 | U$20.12 27.36,38.04 v27.31,38.1
  Bottom 0.152: v27.31,38.1 26.8,38.1 22.12,33.43 v22.12,33.25
IO32_OUT  (via drill 0.35)
  Top 0.152: U2.12 6.41,17.02 v6.4,17.01
  Bottom 0.152: JP5.1 21.69,40.16 20.95,40.89 20.89,40.96 17.25,40.96 16.7,41.5 8.26,41.5 7.34,40.59 7.34,36.78 4.09,33.53 4.09,30.86 7.13,27.82 7.13,17.74 v6.4,17.01
IO33_OUT  (via drill 0.35)
  Top 0.152: U2.13 7.36,16.51 v7.05,16.2
  Bottom 0.152: JP5.2 18.78,38.99 16.57,41.2 8.38,41.2 7.64,40.46 7.64,36.65 4.39,33.4 4.39,30.99 7.43,27.95 7.43,16.58 v7.05,16.2
LNA_IN
  Top 0.152: C8.1 5.84,22.48 6.3,22.02 U2.2
MISO  (via drill 0.35)
  Top 0.152: U$20.13 25.48,36.58 23.75,36.58 21.61,34.44 7.14,34.44 6.22,33.53 6.22,30.61 5.56,29.94 J2.5 2.82,29.94 v2.79,29.97 | U2.18 10.04,16.41 10.04,15.58 9.27,14.81 6.61,14.81 6.43,14.99 5.99,14.99 v5.85,15.12
  Bottom 0.152: v2.79,29.97 2.54,29.97 2.16,29.59 2.16,27.69 2.54,27.3 3.5,27.3 3.76,27.05 3.76,17.34 5.85,15.24 v5.85,15.12
MOSI  (via drill 0.35)
  Top 0.152: U$20.14 25.48,35.67 24.88,36.27 24,36.27 21.87,34.14 7.34,34.14 6.66,33.45 6.66,30.35 5.25,28.94 4.19,28.94 | 4.19,28.94 J2.4 | v9.78,14.48 9.8,14.46 10.51,14.46 11.2,15.15 11.2,15.71 11.14,15.77 U2.20 | v2.79,28.96 4.18,28.96 4.19,28.94
  Bottom 0.152: v9.78,14.48 8.02,14.48 6.5,16 6.5,16.16 4.37,18.29 4.37,27.68 3.1,28.96 v2.79,28.96
N$2
  Top 0.152: C9.2 C8.2 C10.1
N$3
  Top 0.152: C10.2 1.54,21.23 ANT1.1
N$4
  Top 0.508: D2.C 27.81,16.53 L2.2 30.36,17.17 C5.1
N$5
  Top 0.254: R20.1 D6.A
N$6
  Top 0.508: L2.1 27.18,21.11 C1.1 30.16,22.48 C6.1 31.47,22.16 PS1.1
N$7
  Bottom 0.152: X1.3 34.82,34.82 38.25,34.82 39.11,33.96 | JP4.2 39.11,33.96 | 39.11,33.96 39.27,33.81
N$8
  Top 0.152: FL1.2 24.66,13.06 22.95,14.76 U1.7
N$11
  Top 0.152: U1.6 21.68,14.38 23.4,12.67 FL1.3
N$12
  Top 0.152: Q5.1 16.45,17.4 R2.2
N$13
  Top 0.152: R1.2 18.41,13.89 Q6.1
N$16
  Top 0.203: R6.2 21.19,12.53 20.06,11.41 20.06,5.27 SJ9.2
RTS  (via drill 0.35)
  Top 0.152: Q5.2 18.35,17.4 R1.1 19.43,16.32 19.43,12.53 19.43,12.51 18.57,11.65 18.41,11.5 v18.41,9.78
  Bottom 0.152: 11.43,5.08 11.05,4.7 10.54,4.19 8.26,4.19 7.62,3.56 7.62,1.14 8.26,0.51 17.14,0.51 18.41,1.78 v18.41,9.78
  Bottom 0.254: TC1.3 11.43,5.08
RXD0  (via drill 0.35)
  Top 0.152: U2.40 11.64,23.81 v11.9,24.07 | v15.76,12.34 15.76,9.39 v16.13,9.02
  Bottom 0.152: v15.76,12.34 15.9,12.19 16.76,12.19 17.14,12.57 17.14,13.21 16.59,13.77 14.35,13.77 14.02,14.1 14.02,22.86 13.59,23.29 12.45,23.29 11.9,23.83 v11.9,24.07 | TC1.4 13.85,4.18 15.49,4.06 16.55,5.12 16.55,8.59 v16.13,9.02
SCK  (via drill 0.35)
  Top 0.152: U$20.15 24.68,35.97 24.26,35.97 22.12,33.83 7.59,33.83 7.09,33.33 7.09,29.95 5.08,27.94 J2.3 v2.79,27.94 | U2.17 9.64,15.61 9.14,15.11 6.73,15.11 v5.97,15.88
  Bottom 0.152: v5.97,15.88 4.06,17.78 4.06,27.56 3.68,27.94 v2.79,27.94
SCL  (via drill 0.35)
  Top 0.152: U2.39 12.24,23.13 12.24,23.35 12.7,23.81 v12.7,24 | v5.46,31.88 4.17,31.88 J2.7
  Top 0.254: R17.1 12.4,37.33 JP1.3
  Bottom 0.152: v12.7,24 12.43,24.27 12.43,24.29 11.98,24.74 9.47,24.74 8.56,25.65 8.56,30.48 7.16,31.88 v5.46,31.88 10.29,31.88 14.07,35.66 JP1.3
SDA  (via drill 0.35)
  Top 0.152: U2.42 10.64,23.83 v10.32,24.16 | v5.46,30.86 4.18,30.86 J2.6
  Top 0.254: R13.1 16.45,38.84 JP1.4
  Bottom 0.152: v10.32,24.16 9.62,24.16 8.26,25.53 8.26,30.35 7.75,30.86 v5.46,30.86 4.95,30.86 4.7,31.11 4.7,33.27 7.11,35.69 7.95,36.52 7.95,40.34 8.51,40.89 16.13,40.89 16.61,40.41 JP1.4
TXD0  (via drill 0.35)
  Top 0.152: U2.41 v11.15,24.07 | 16.68,12.66 v16.51,12.83 16.51,11.79 16.53,11.77 16.53,10.9 16.53,10.77 v17.27,10.03
  Bottom 0.152: v11.15,24.07 11.15,23.52 11.68,22.99 13.46,22.99 13.72,22.73 13.72,13.97 14.22,13.46 15.88,13.46 v16.51,12.83 | 13.21,3.56 13.21,1.78 13.72,1.27 14.1,0.89 17.02,0.89 17.78,1.65 17.78,9.53 v17.27,10.03
  Bottom 0.254: TC1.2 13.21,3.56

### Text on the board
tPlace: MuST | RESET | Messplatine v2 / Helene Roboterarm / Sven Suppelt 11.2021 | - | 120R | CANH/CANL | +24V GND
bPlace: GND / SCL / SDA / MISO / MOSI / SCK / IO14 / 3V3 | 32 / 33 / SDA / SCL / 3V3 / GND | Ud- / Us- / Sch / Us+ / Ud+ | L / H | GND / +24V